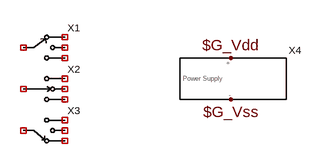
[diagram p0: schematic sp3t_test.asc]
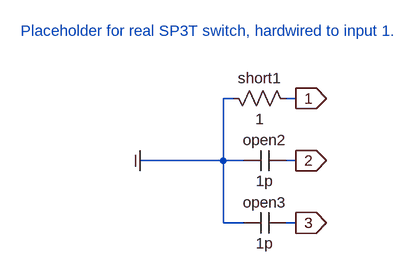
[diagram p1: sub-circuit sp3t-1.asc]
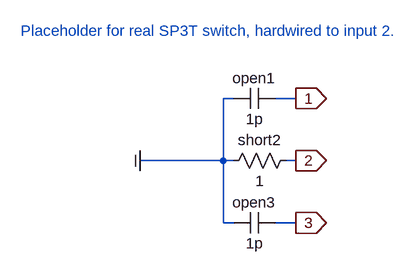
[diagram p2: sub-circuit sp3t-2.asc]
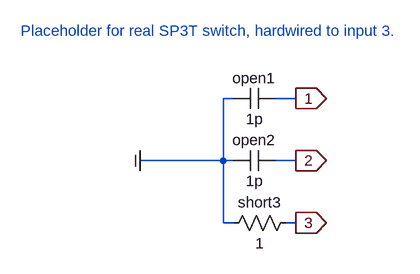
[diagram p3: sub-circuit sp3t-3.asc]
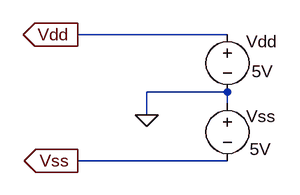
[diagram p4: sub-circuit tpower.asc]
sp3t_test.asc, the LTspice schematic file:
Version 4
SHEET 1 880 680
FLAG 416 176 $G_Vss
FLAG 416 112 $G_Vdd
SYMBOL sp3t-1 160 96 R0
SYMATTR InstName X1
SYMBOL sp3t-2 160 160 R0
SYMATTR InstName X2
SYMBOL sp3t-3 160 224 R0
SYMATTR InstName X3
SYMBOL tpower 416 144 R0
SYMATTR InstName X4

sp3t-1.asc, the sub-circuit schematic file:
Version 4
SHEET 1 880 680
WIRE 144 64 128 64
WIRE 240 64 224 64
WIRE 128 160 128 64
WIRE 128 160 0 160
WIRE 160 160 128 160
WIRE 240 160 224 160
WIRE 128 256 128 160
WIRE 160 256 128 256
WIRE 240 256 224 256
FLAG 0 160 COM
IOPIN 0 160 In
FLAG 240 64 1
IOPIN 240 64 Out
FLAG 240 160 2
IOPIN 240 160 Out
FLAG 240 256 3
IOPIN 240 256 Out
SYMBOL res 128 48 M90
WINDOW 0 0 56 VBottom 0
WINDOW 3 32 56 VTop 0
SYMATTR InstName short1
SYMATTR Value 1
SYMBOL cap 224 144 R90
WINDOW 0 0 32 VBottom 0
WINDOW 3 32 32 VTop 0
SYMATTR InstName open2
SYMATTR Value 1p
SYMBOL cap 224 240 R90
WINDOW 0 0 32 VBottom 0
WINDOW 3 32 32 VTop 0
SYMATTR InstName open3
SYMATTR Value 1p
TEXT -184 -40 Left 0 ;Placeholder for real SP3T switch, hardwired to input 1.

sp3t-2.asc, the sub-circuit schematic file:
Version 4
SHEET 1 880 680
WIRE 144 64 128 64
WIRE 240 64 208 64
WIRE 128 160 128 64
WIRE 128 160 0 160
WIRE 144 160 128 160
WIRE 240 160 224 160
WIRE 128 256 128 160
WIRE 144 256 128 256
WIRE 240 256 208 256
FLAG 0 160 COM
IOPIN 0 160 In
FLAG 240 64 1
IOPIN 240 64 Out
FLAG 240 160 2
IOPIN 240 160 Out
FLAG 240 256 3
IOPIN 240 256 Out
SYMBOL cap 208 48 R90
WINDOW 0 0 32 VBottom 0
WINDOW 3 32 32 VTop 0
SYMATTR InstName open1
SYMATTR Value 1p
SYMBOL cap 208 240 R90
WINDOW 0 0 32 VBottom 0
WINDOW 3 32 32 VTop 0
SYMATTR InstName open3
SYMATTR Value 1p
SYMBOL res 240 144 R90
WINDOW 0 0 56 VBottom 0
WINDOW 3 32 56 VTop 0
SYMATTR InstName short2
SYMATTR Value 1
TEXT -184 -40 Left 0 ;Placeholder for real SP3T switch, hardwired to input 2.

sp3t-3.asc, the sub-circuit schematic file:
Version 4
SHEET 1 880 680
WIRE 144 64 128 64
WIRE 240 64 208 64
WIRE 128 160 128 64
WIRE 128 160 0 160
WIRE 144 160 128 160
WIRE 240 160 208 160
WIRE 128 256 128 160
WIRE 144 256 128 256
WIRE 240 256 224 256
FLAG 0 160 COM
IOPIN 0 160 In
FLAG 240 64 1
IOPIN 240 64 Out
FLAG 240 160 2
IOPIN 240 160 Out
FLAG 240 256 3
IOPIN 240 256 Out
SYMBOL cap 144 48 M90
WINDOW 0 0 32 VBottom 0
WINDOW 3 32 32 VTop 0
SYMATTR InstName open1
SYMATTR Value 1p
SYMBOL cap 144 144 M90
WINDOW 0 0 32 VBottom 0
WINDOW 3 32 32 VTop 0
SYMATTR InstName open2
SYMATTR Value 1p
SYMBOL res 240 240 R90
WINDOW 0 0 56 VBottom 0
WINDOW 3 32 56 VTop 0
SYMATTR InstName short3
SYMATTR Value 1
TEXT -184 -40 Left 0 ;Placeholder for real SP3T switch, hardwired to input 3.

tpower.asc, the sub-circuit schematic file:
Version 4
SHEET 1 880 680
WIRE -112 32 -320 32
WIRE -112 112 -224 112
WIRE -112 128 -112 112
WIRE -224 144 -224 112
WIRE -112 208 -320 208
FLAG -224 144 0
FLAG -320 32 Vdd
IOPIN -320 32 Out
FLAG -320 208 Vss
IOPIN -320 208 Out
SYMBOL voltage -112 16 R0
WINDOW 0 26 26 Left 0
WINDOW 3 34 68 Left 0
SYMATTR InstName Vdd
SYMATTR Value 5V
SYMBOL voltage -112 112 R0
WINDOW 0 26 34 Left 0
WINDOW 3 31 80 Left 0
SYMATTR InstName Vss
SYMATTR Value 5V

The netlist it stands for:
* sp3t_test.asc
XX1 NC_01 NC_02 NC_03 NC_04 sp3t-1
XX2 NC_05 NC_06 NC_07 NC_08 sp3t-2
XX3 NC_09 NC_10 NC_11 NC_12 sp3t-3
XX4 $G_Vdd $G_Vss tpower

* block symbol definitions
.subckt sp3t-1 1 2 COM 3
R§short1 COM 1 1
C§open2 2 COM 1p
C§open3 3 COM 1p
* Placeholder for real SP3T switch, hardwired to input 1.
.ends sp3t-1

.subckt sp3t-2 1 2 COM 3
C§open1 1 COM 1p
C§open3 3 COM 1p
R§short2 2 COM 1
* Placeholder for real SP3T switch, hardwired to input 2.
.ends sp3t-2

.subckt sp3t-3 1 2 COM 3
C§open1 COM 1 1p
C§open2 COM 2 1p
R§short3 3 COM 1
* Placeholder for real SP3T switch, hardwired to input 3.
.ends sp3t-3

.subckt tpower Vdd Vss
Vdd Vdd 0 5V
Vss 0 Vss 5V
.ends tpower

.backanno
.end